# EasyEDA schematic 1-Schematic_hub84_board.json
TITLE: Sheet_3; REV: 1.0; Date: 2025-08-21; Sheet: 1/1; Drawn By: remlin_0202; Company: Your Company
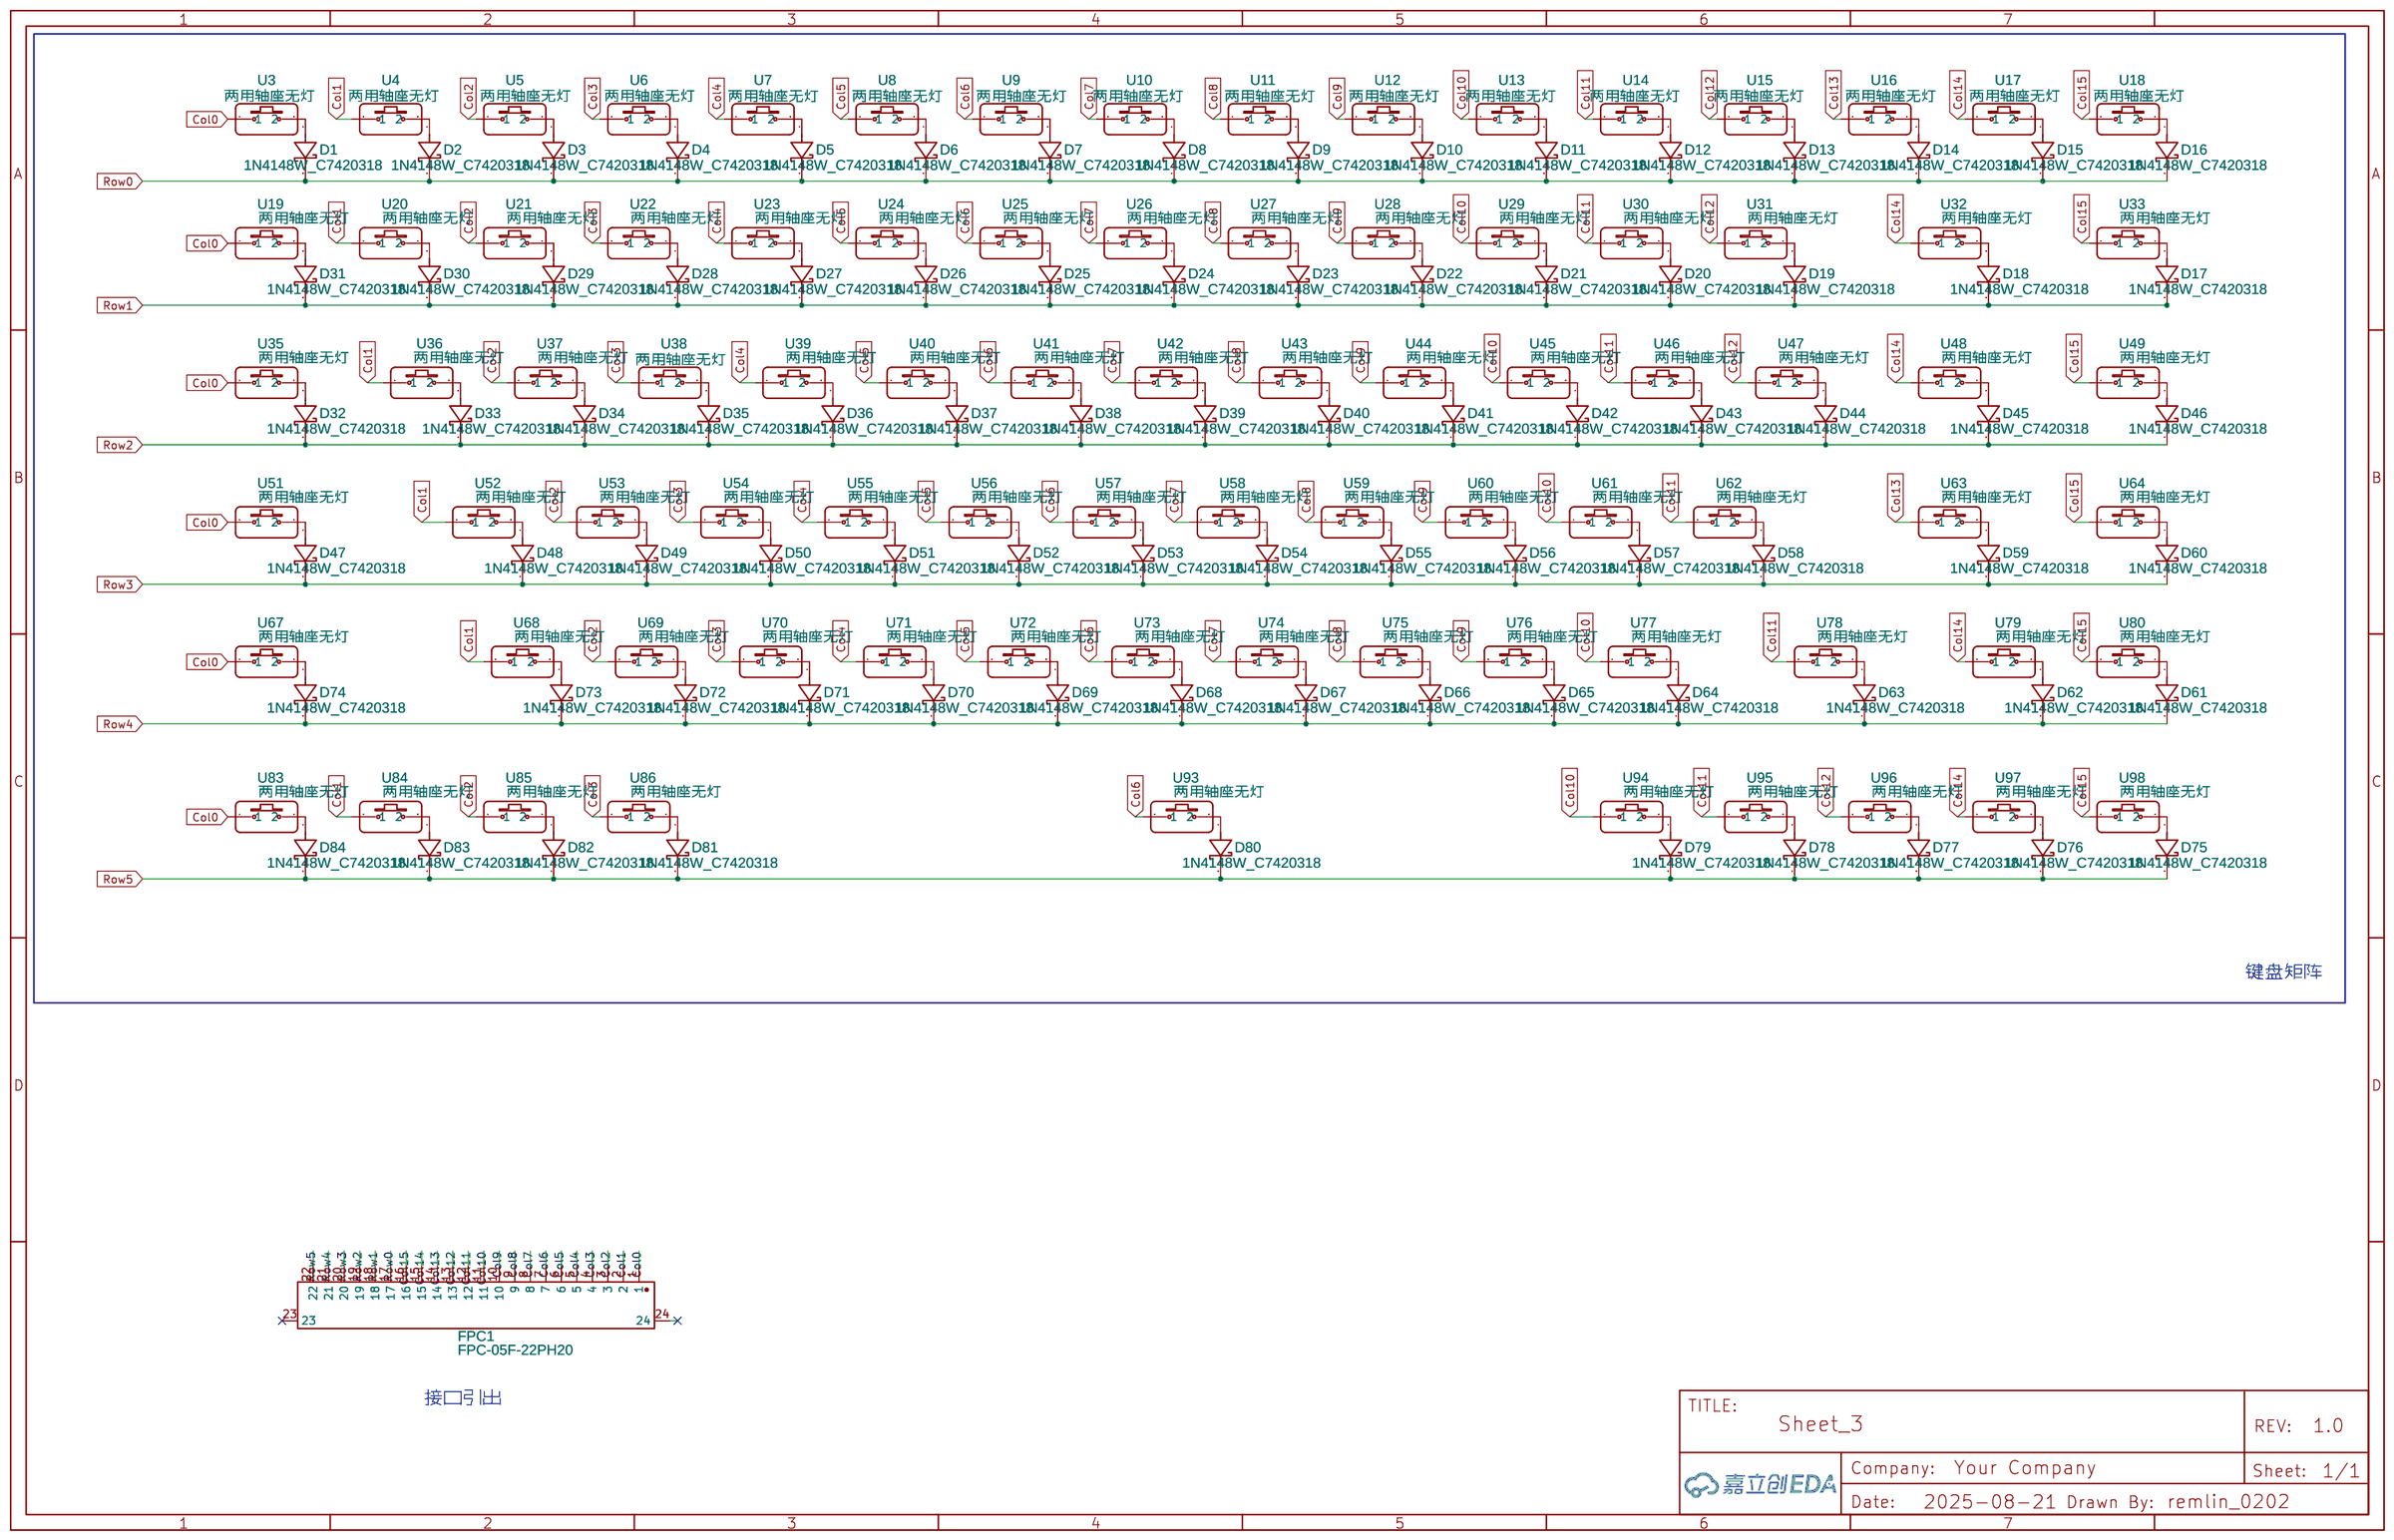
[diagram p0: schematic sheet]

## Parts
D1  1N4148W_C7420318  [SOD-123_L2.7-W1.6-LS3.7-FD]
D2  1N4148W_C7420318  [SOD-123_L2.7-W1.6-LS3.7-FD]
D3  1N4148W_C7420318  [SOD-123_L2.7-W1.6-LS3.7-FD]
D4  1N4148W_C7420318  [SOD-123_L2.7-W1.6-LS3.7-FD]
D5  1N4148W_C7420318  [SOD-123_L2.7-W1.6-LS3.7-FD]
D6  1N4148W_C7420318  [SOD-123_L2.7-W1.6-LS3.7-FD]
D7  1N4148W_C7420318  [SOD-123_L2.7-W1.6-LS3.7-FD]
D8  1N4148W_C7420318  [SOD-123_L2.7-W1.6-LS3.7-FD]
D9  1N4148W_C7420318  [SOD-123_L2.7-W1.6-LS3.7-FD]
D10  1N4148W_C7420318  [SOD-123_L2.7-W1.6-LS3.7-FD]
D11  1N4148W_C7420318  [SOD-123_L2.7-W1.6-LS3.7-FD]
D12  1N4148W_C7420318  [SOD-123_L2.7-W1.6-LS3.7-FD]
D13  1N4148W_C7420318  [SOD-123_L2.7-W1.6-LS3.7-FD]
D14  1N4148W_C7420318  [SOD-123_L2.7-W1.6-LS3.7-FD]
D15  1N4148W_C7420318  [SOD-123_L2.7-W1.6-LS3.7-FD]
D16  1N4148W_C7420318  [SOD-123_L2.7-W1.6-LS3.7-FD]
D17  1N4148W_C7420318  [SOD-123_L2.7-W1.6-LS3.7-FD]
D18  1N4148W_C7420318  [SOD-123_L2.7-W1.6-LS3.7-FD]
D19  1N4148W_C7420318  [SOD-123_L2.7-W1.6-LS3.7-FD]
D20  1N4148W_C7420318  [SOD-123_L2.7-W1.6-LS3.7-FD]
D21  1N4148W_C7420318  [SOD-123_L2.7-W1.6-LS3.7-FD]
D22  1N4148W_C7420318  [SOD-123_L2.7-W1.6-LS3.7-FD]
D23  1N4148W_C7420318  [SOD-123_L2.7-W1.6-LS3.7-FD]
D24  1N4148W_C7420318  [SOD-123_L2.7-W1.6-LS3.7-FD]
D25  1N4148W_C7420318  [SOD-123_L2.7-W1.6-LS3.7-FD]
D26  1N4148W_C7420318  [SOD-123_L2.7-W1.6-LS3.7-FD]
D27  1N4148W_C7420318  [SOD-123_L2.7-W1.6-LS3.7-FD]
D28  1N4148W_C7420318  [SOD-123_L2.7-W1.6-LS3.7-FD]
D29  1N4148W_C7420318  [SOD-123_L2.7-W1.6-LS3.7-FD]
D30  1N4148W_C7420318  [SOD-123_L2.7-W1.6-LS3.7-FD]
D31  1N4148W_C7420318  [SOD-123_L2.7-W1.6-LS3.7-FD]
D32  1N4148W_C7420318  [SOD-123_L2.7-W1.6-LS3.7-FD]
D33  1N4148W_C7420318  [SOD-123_L2.7-W1.6-LS3.7-FD]
D34  1N4148W_C7420318  [SOD-123_L2.7-W1.6-LS3.7-FD]
D35  1N4148W_C7420318  [SOD-123_L2.7-W1.6-LS3.7-FD]
D36  1N4148W_C7420318  [SOD-123_L2.7-W1.6-LS3.7-FD]
D37  1N4148W_C7420318  [SOD-123_L2.7-W1.6-LS3.7-FD]
D38  1N4148W_C7420318  [SOD-123_L2.7-W1.6-LS3.7-FD]
D39  1N4148W_C7420318  [SOD-123_L2.7-W1.6-LS3.7-FD]
D40  1N4148W_C7420318  [SOD-123_L2.7-W1.6-LS3.7-FD]
D41  1N4148W_C7420318  [SOD-123_L2.7-W1.6-LS3.7-FD]
D42  1N4148W_C7420318  [SOD-123_L2.7-W1.6-LS3.7-FD]
D43  1N4148W_C7420318  [SOD-123_L2.7-W1.6-LS3.7-FD]
D44  1N4148W_C7420318  [SOD-123_L2.7-W1.6-LS3.7-FD]
D45  1N4148W_C7420318  [SOD-123_L2.7-W1.6-LS3.7-FD]
D46  1N4148W_C7420318  [SOD-123_L2.7-W1.6-LS3.7-FD]
D47  1N4148W_C7420318  [SOD-123_L2.7-W1.6-LS3.7-FD]
D48  1N4148W_C7420318  [SOD-123_L2.7-W1.6-LS3.7-FD]
D49  1N4148W_C7420318  [SOD-123_L2.7-W1.6-LS3.7-FD]
D50  1N4148W_C7420318  [SOD-123_L2.7-W1.6-LS3.7-FD]
D51  1N4148W_C7420318  [SOD-123_L2.7-W1.6-LS3.7-FD]
D52  1N4148W_C7420318  [SOD-123_L2.7-W1.6-LS3.7-FD]
D53  1N4148W_C7420318  [SOD-123_L2.7-W1.6-LS3.7-FD]
D54  1N4148W_C7420318  [SOD-123_L2.7-W1.6-LS3.7-FD]
D55  1N4148W_C7420318  [SOD-123_L2.7-W1.6-LS3.7-FD]
D56  1N4148W_C7420318  [SOD-123_L2.7-W1.6-LS3.7-FD]
D57  1N4148W_C7420318  [SOD-123_L2.7-W1.6-LS3.7-FD]
D58  1N4148W_C7420318  [SOD-123_L2.7-W1.6-LS3.7-FD]
D59  1N4148W_C7420318  [SOD-123_L2.7-W1.6-LS3.7-FD]
D60  1N4148W_C7420318  [SOD-123_L2.7-W1.6-LS3.7-FD]
D61  1N4148W_C7420318  [SOD-123_L2.7-W1.6-LS3.7-FD]
D62  1N4148W_C7420318  [SOD-123_L2.7-W1.6-LS3.7-FD]
D63  1N4148W_C7420318  [SOD-123_L2.7-W1.6-LS3.7-FD]
D64  1N4148W_C7420318  [SOD-123_L2.7-W1.6-LS3.7-FD]
D65  1N4148W_C7420318  [SOD-123_L2.7-W1.6-LS3.7-FD]
D66  1N4148W_C7420318  [SOD-123_L2.7-W1.6-LS3.7-FD]
D67  1N4148W_C7420318  [SOD-123_L2.7-W1.6-LS3.7-FD]
D68  1N4148W_C7420318  [SOD-123_L2.7-W1.6-LS3.7-FD]
D69  1N4148W_C7420318  [SOD-123_L2.7-W1.6-LS3.7-FD]
D70  1N4148W_C7420318  [SOD-123_L2.7-W1.6-LS3.7-FD]
D71  1N4148W_C7420318  [SOD-123_L2.7-W1.6-LS3.7-FD]
D72  1N4148W_C7420318  [SOD-123_L2.7-W1.6-LS3.7-FD]
D73  1N4148W_C7420318  [SOD-123_L2.7-W1.6-LS3.7-FD]
D74  1N4148W_C7420318  [SOD-123_L2.7-W1.6-LS3.7-FD]
D75  1N4148W_C7420318  [SOD-123_L2.7-W1.6-LS3.7-FD]
D76  1N4148W_C7420318  [SOD-123_L2.7-W1.6-LS3.7-FD]
D77  1N4148W_C7420318  [SOD-123_L2.7-W1.6-LS3.7-FD]
D78  1N4148W_C7420318  [SOD-123_L2.7-W1.6-LS3.7-FD]
D79  1N4148W_C7420318  [SOD-123_L2.7-W1.6-LS3.7-FD]
D80  1N4148W_C7420318  [SOD-123_L2.7-W1.6-LS3.7-FD]
D81  1N4148W_C7420318  [SOD-123_L2.7-W1.6-LS3.7-FD]
D82  1N4148W_C7420318  [SOD-123_L2.7-W1.6-LS3.7-FD]
D83  1N4148W_C7420318  [SOD-123_L2.7-W1.6-LS3.7-FD]
D84  1N4148W_C7420318  [SOD-123_L2.7-W1.6-LS3.7-FD]
FPC1  FPC-05F-22PH20  [FPC-SMD_22P-P0.50_FPC-05F-22PH20]
U3  两用轴座无灯  [两用轴座无灯]
U4  两用轴座无灯  [两用轴座无灯]
U5  两用轴座无灯  [两用轴座无灯]
U6  两用轴座无灯  [两用轴座无灯]
U7  两用轴座无灯  [两用轴座无灯]
U8  两用轴座无灯  [两用轴座无灯]
U9  两用轴座无灯  [两用轴座无灯]
U10  两用轴座无灯  [两用轴座无灯]
U11  两用轴座无灯  [两用轴座无灯]
U12  两用轴座无灯  [两用轴座无灯]
U13  两用轴座无灯  [两用轴座无灯]
U14  两用轴座无灯  [两用轴座无灯]
U15  两用轴座无灯  [两用轴座无灯]
U16  两用轴座无灯  [两用轴座无灯]
U17  两用轴座无灯  [两用轴座无灯]
U18  两用轴座无灯  [两用轴座无灯]
U19  两用轴座无灯  [两用轴座无灯]
U20  两用轴座无灯  [两用轴座无灯]
U21  两用轴座无灯  [两用轴座无灯]
U22  两用轴座无灯  [两用轴座无灯]
U23  两用轴座无灯  [两用轴座无灯]
U24  两用轴座无灯  [两用轴座无灯]
U25  两用轴座无灯  [两用轴座无灯]
U26  两用轴座无灯  [两用轴座无灯]
U27  两用轴座无灯  [两用轴座无灯]
U28  两用轴座无灯  [两用轴座无灯]
U29  两用轴座无灯  [两用轴座无灯]
U30  两用轴座无灯  [两用轴座无灯]
U31  两用轴座无灯  [两用轴座无灯]
U32  两用轴座无灯  [两用轴座无灯]
U33  两用轴座无灯  [两用轴座无灯]
U35  两用轴座无灯  [两用轴座无灯]
U36  两用轴座无灯  [两用轴座无灯]
U37  两用轴座无灯  [两用轴座无灯]
U38  两用轴座无灯  [两用轴座无灯]
U39  两用轴座无灯  [两用轴座无灯]
U40  两用轴座无灯  [两用轴座无灯]
U41  两用轴座无灯  [两用轴座无灯]
U42  两用轴座无灯  [两用轴座无灯]
U43  两用轴座无灯  [两用轴座无灯]
U44  两用轴座无灯  [两用轴座无灯]
U45  两用轴座无灯  [两用轴座无灯]
U46  两用轴座无灯  [两用轴座无灯]
U47  两用轴座无灯  [两用轴座无灯]
U48  两用轴座无灯  [两用轴座无灯]
U49  两用轴座无灯  [两用轴座无灯]
U51  两用轴座无灯  [两用轴座无灯]
U52  两用轴座无灯  [两用轴座无灯]
U53  两用轴座无灯  [两用轴座无灯]
U54  两用轴座无灯  [两用轴座无灯]
U55  两用轴座无灯  [两用轴座无灯]
U56  两用轴座无灯  [两用轴座无灯]
U57  两用轴座无灯  [两用轴座无灯]
U58  两用轴座无灯  [两用轴座无灯]
U59  两用轴座无灯  [两用轴座无灯]
U60  两用轴座无灯  [两用轴座无灯]
U61  两用轴座无灯  [两用轴座无灯]
U62  两用轴座无灯  [两用轴座无灯]
U63  两用轴座无灯  [两用轴座无灯]
U64  两用轴座无灯  [两用轴座无灯]
U67  两用轴座无灯  [两用轴座无灯]
U68  两用轴座无灯  [两用轴座无灯]
U69  两用轴座无灯  [两用轴座无灯]
U70  两用轴座无灯  [两用轴座无灯]
U71  两用轴座无灯  [两用轴座无灯]
U72  两用轴座无灯  [两用轴座无灯]
U73  两用轴座无灯  [两用轴座无灯]
U74  两用轴座无灯  [两用轴座无灯]
U75  两用轴座无灯  [两用轴座无灯]
U76  两用轴座无灯  [两用轴座无灯]
U77  两用轴座无灯  [两用轴座无灯]
U78  两用轴座无灯  [两用轴座无灯]
U79  两用轴座无灯  [两用轴座无灯]
U80  两用轴座无灯  [两用轴座无灯]
U83  两用轴座无灯  [两用轴座无灯]
U84  两用轴座无灯  [两用轴座无灯]
U85  两用轴座无灯  [两用轴座无灯]
U86  两用轴座无灯  [两用轴座无灯]
U93  两用轴座无灯  [两用轴座无灯]
U94  两用轴座无灯  [两用轴座无灯]
U95  两用轴座无灯  [两用轴座无灯]
U96  两用轴座无灯  [两用轴座无灯]
U97  两用轴座无灯  [两用轴座无灯]
U98  两用轴座无灯  [两用轴座无灯]

## Library data of the parts
D1-D84 = 1N4148W_C7420318: Supplier: LCSC; Supplier Part: C7420318; Manufacturer: 宏嘉诚; Manufacturer Part: 1N4148W; JLCPCB Part Class: Extended Part; Contributor: lcsc
FPC1 = FPC-05F-22PH20: Contributor: LCSC; Supplier: LCSC; Supplier Part: C2856804; Manufacturer: XUNPU(讯普); JLCPCB Part Class: Extended Part
U3-U33 U35-U49 U51-U64 U67-U80 U83-U86 U93-U98 = 两用轴座无灯: Contributor: skyvessel

## Nets
Col0: FPC1.1 U3.1 U19.1 U35.1 U51.1 U67.1 U83.1
Col1: FPC1.2 U4.1 U20.1 U36.1 U52.1 U68.1 U84.1
Col2: FPC1.3 U5.1 U21.1 U37.1 U53.1 U69.1 U85.1
Col3: FPC1.4 U6.1 U22.1 U38.1 U54.1 U70.1 U86.1
Col4: FPC1.5 U7.1 U23.1 U39.1 U55.1 U71.1
Col5: FPC1.6 U8.1 U24.1 U40.1 U56.1 U72.1
Col6: FPC1.7 U9.1 U25.1 U41.1 U57.1 U73.1 U93.1
Col7: FPC1.8 U10.1 U26.1 U42.1 U58.1 U74.1
Col8: FPC1.9 U11.1 U27.1 U43.1 U59.1 U75.1
Col9: FPC1.10 U12.1 U28.1 U44.1 U60.1 U76.1
Col10: FPC1.11 U13.1 U29.1 U45.1 U61.1 U77.1 U94.1
Col11: FPC1.12 U14.1 U30.1 U46.1 U62.1 U78.1 U95.1
Col12: FPC1.13 U15.1 U31.1 U47.1 U96.1
Col13: FPC1.14 U16.1 U63.1
Col14: FPC1.15 U17.1 U32.1 U48.1 U79.1 U97.1
Col15: FPC1.16 U18.1 U33.1 U49.1 U64.1 U80.1 U98.1
Row0: D1.2(K) D2.2(K) D3.2(K) D4.2(K) D5.2(K) D6.2(K) D7.2(K) D8.2(K) D9.2(K) D10.2(K) D11.2(K) D12.2(K) D13.2(K) D14.2(K) D15.2(K) D16.2(K) FPC1.17
Row1: D17.2(K) D18.2(K) D19.2(K) D20.2(K) D21.2(K) D22.2(K) D23.2(K) D24.2(K) D25.2(K) D26.2(K) D27.2(K) D28.2(K) D29.2(K) D30.2(K) D31.2(K) FPC1.18
Row2: D32.2(K) D33.2(K) D34.2(K) D35.2(K) D36.2(K) D37.2(K) D38.2(K) D39.2(K) D40.2(K) D41.2(K) D42.2(K) D43.2(K) D44.2(K) D45.2(K) D46.2(K) FPC1.19
Row3: D47.2(K) D48.2(K) D49.2(K) D50.2(K) D51.2(K) D52.2(K) D53.2(K) D54.2(K) D55.2(K) D56.2(K) D57.2(K) D58.2(K) D59.2(K) D60.2(K) FPC1.20
Row4: D61.2(K) D62.2(K) D63.2(K) D64.2(K) D65.2(K) D66.2(K) D67.2(K) D68.2(K) D69.2(K) D70.2(K) D71.2(K) D72.2(K) D73.2(K) D74.2(K) FPC1.21
Row5: D75.2(K) D76.2(K) D77.2(K) D78.2(K) D79.2(K) D80.2(K) D81.2(K) D82.2(K) D83.2(K) D84.2(K) FPC1.22
Net-(D1-1): D1.1(A) U3.2
Net-(D2-1): D2.1(A) U4.2
Net-(D3-1): D3.1(A) U5.2
Net-(D4-1): D4.1(A) U6.2
Net-(D5-1): D5.1(A) U7.2
Net-(D6-1): D6.1(A) U8.2
Net-(D7-1): D7.1(A) U9.2
Net-(D8-1): D8.1(A) U10.2
Net-(D9-1): D9.1(A) U11.2
Net-(D10-1): D10.1(A) U12.2
Net-(D11-1): D11.1(A) U13.2
Net-(D12-1): D12.1(A) U14.2
Net-(D13-1): D13.1(A) U15.2
Net-(D14-1): D14.1(A) U16.2
Net-(D15-1): D15.1(A) U17.2
Net-(D16-1): D16.1(A) U18.2
Net-(D17-1): D17.1(A) U33.2
Net-(D18-1): D18.1(A) U32.2
Net-(D19-1): D19.1(A) U31.2
Net-(D20-1): D20.1(A) U30.2
Net-(D21-1): D21.1(A) U29.2
Net-(D22-1): D22.1(A) U28.2
Net-(D23-1): D23.1(A) U27.2
Net-(D24-1): D24.1(A) U26.2
Net-(D25-1): D25.1(A) U25.2
Net-(D26-1): D26.1(A) U24.2
Net-(D27-1): D27.1(A) U23.2
Net-(D28-1): D28.1(A) U22.2
Net-(D29-1): D29.1(A) U21.2
Net-(D30-1): D30.1(A) U20.2
Net-(D31-1): D31.1(A) U19.2
Net-(D32-1): D32.1(A) U35.2
Net-(D33-1): D33.1(A) U36.2
Net-(D34-1): D34.1(A) U37.2
Net-(D35-1): D35.1(A) U38.2
Net-(D36-1): D36.1(A) U39.2
Net-(D37-1): D37.1(A) U40.2
Net-(D38-1): D38.1(A) U41.2
Net-(D39-1): D39.1(A) U42.2
Net-(D40-1): D40.1(A) U43.2
Net-(D41-1): D41.1(A) U44.2
Net-(D42-1): D42.1(A) U45.2
Net-(D43-1): D43.1(A) U46.2
Net-(D44-1): D44.1(A) U47.2
Net-(D45-1): D45.1(A) U48.2
Net-(D46-1): D46.1(A) U49.2
Net-(D47-1): D47.1(A) U51.2
Net-(D48-1): D48.1(A) U52.2
Net-(D49-1): D49.1(A) U53.2
Net-(D50-1): D50.1(A) U54.2
Net-(D51-1): D51.1(A) U55.2
Net-(D52-1): D52.1(A) U56.2
Net-(D53-1): D53.1(A) U57.2
Net-(D54-1): D54.1(A) U58.2
Net-(D55-1): D55.1(A) U59.2
Net-(D56-1): D56.1(A) U60.2
Net-(D57-1): D57.1(A) U61.2
Net-(D58-1): D58.1(A) U62.2
Net-(D59-1): D59.1(A) U63.2
Net-(D60-1): D60.1(A) U64.2
Net-(D61-1): D61.1(A) U80.2
Net-(D62-1): D62.1(A) U79.2
Net-(D63-1): D63.1(A) U78.2
Net-(D64-1): D64.1(A) U77.2
Net-(D65-1): D65.1(A) U76.2
Net-(D66-1): D66.1(A) U75.2
Net-(D67-1): D67.1(A) U74.2
Net-(D68-1): D68.1(A) U73.2
Net-(D69-1): D69.1(A) U72.2
Net-(D70-1): D70.1(A) U71.2
Net-(D71-1): D71.1(A) U70.2
Net-(D72-1): D72.1(A) U69.2
Net-(D73-1): D73.1(A) U68.2
Net-(D74-1): D74.1(A) U67.2
Net-(D75-1): D75.1(A) U98.2
Net-(D76-1): D76.1(A) U97.2
Net-(D77-1): D77.1(A) U96.2
Net-(D78-1): D78.1(A) U95.2
Net-(D79-1): D79.1(A) U94.2
Net-(D80-1): D80.1(A) U93.2
Net-(D81-1): D81.1(A) U86.2
Net-(D82-1): D82.1(A) U85.2
Net-(D83-1): D83.1(A) U84.2
Net-(D84-1): D84.1(A) U83.2

Not connected (* = marked no-connect by the designer): FPC1 23* 24

## Notes on the sheet
- 键盘矩阵
- 接口引出
